# Altium schematic sheet MCU.SchDoc
size A
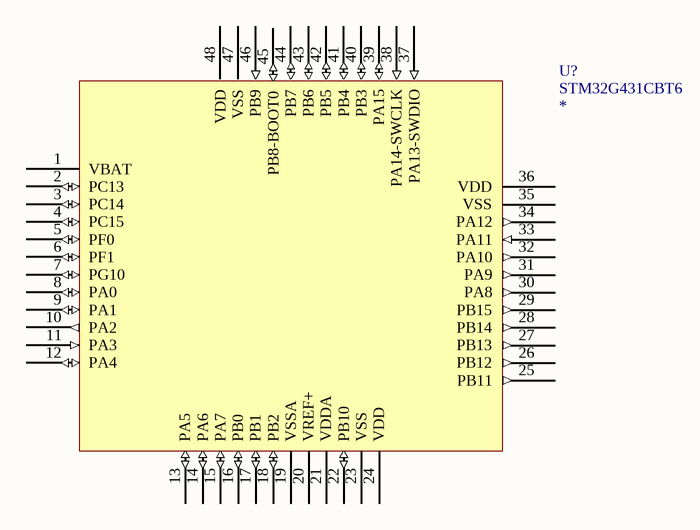
[diagram p0: MCU.SchDoc]

## Parts
U?  STM32G431CBT6  [LQFP48-7x7mm]

## Nets

Not connected (* = marked no-connect by the designer): U? 1(VBAT) 2(PC13) 3(PC14) 4(PC15) 5(PF0) 6(PF1) 7(PG10) 8(PA0) 9(PA1) 10(PA2) 11(PA3) 12(PA4) 13(PA5) 14(PA6) 15(PA7) 16(PB0) 17(PB1) 18(PB2) 19(VSSA) 20(VREF+) 21(VDDA) 22(PB10) 23(VSS) 24(VDD) 25(PB11) 26(PB12) 27(PB13) 28(PB14) 29(PB15) 30(PA8) 31(PA9) 32(PA10) 33(PA11) 34(PA12) 35(VSS) 36(VDD) 37(PA13-SWDIO) 38(PA14-SWCLK) 39(PA15) 40(PB3) 41(PB4) 42(PB5) 43(PB6) 44(PB7) 45(PB8-BOOT0) 46(PB9) 47(VSS) 48(VDD)

## Library data of the parts
U? = IC-STM32G431CBT6: ARM® Cortex®-M4F STM32G4 Microcontroller IC 32-Bit Single-Core 170MHz 128KB (128K x 8) FLASH 48-LQFP (7x7); Parameter 1: *